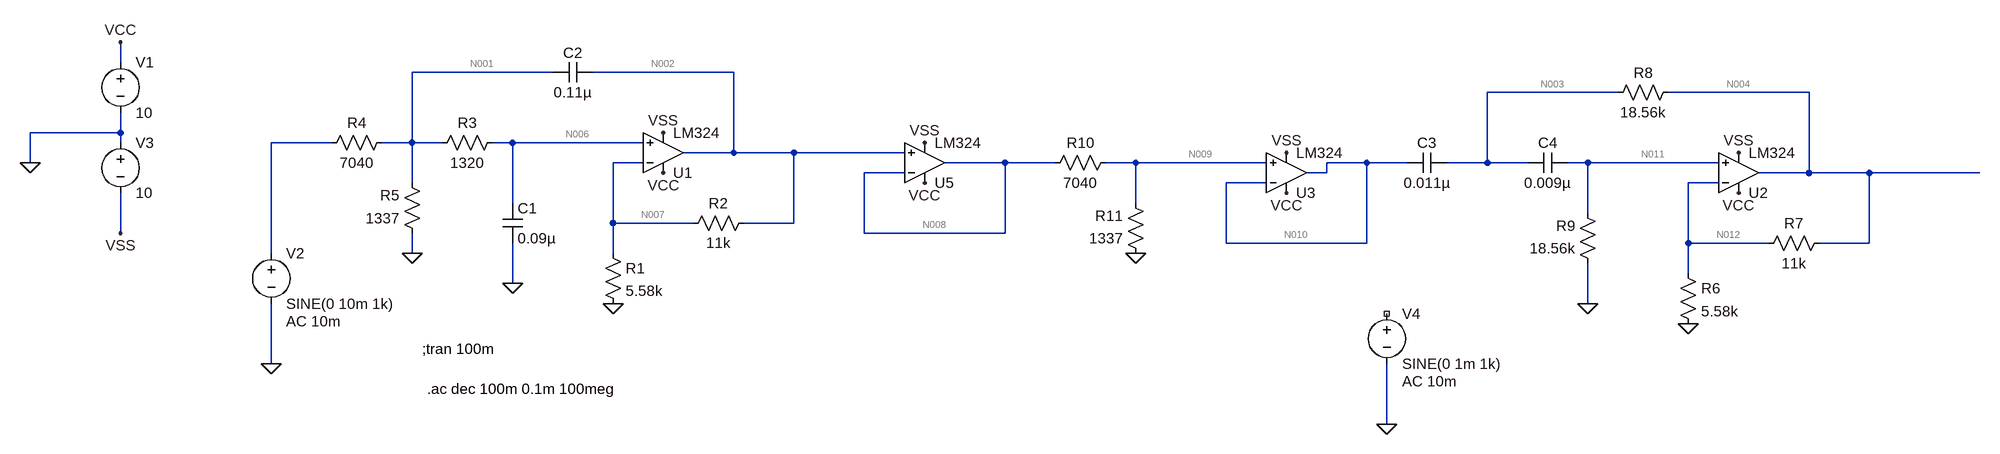
[diagram p0: schematic simulacion1_10porciento.asc]
* simulacion1_10porciento.asc
* U1: LM324 (symbol AutoGenerated\LM324 not available, pins judged from their places): In+=N006 In-=N007 V+=VCC V-=VSS OUT=N002
V1 VCC 0 10
R1 N007 0 5.58k
R2 N002 N007 11k
V2 N005 0 SINE(0 10m 1k) AC 10m
V3 0 VSS 10
C1 N006 0 0.09µ
R3 N006 N001 1320
R4 N001 N005 7040
C2 N002 N001 0.11µ
R5 0 N001 1337
* U2: LM324 (symbol AutoGenerated\LM324 not available, pins judged from their places): In+=N011 In-=N012 V+=VCC V-=VSS OUT=N004
R6 N012 0 5.58k
R7 N004 N012 11k
V4 NC_01 0 SINE(0 1m 1k) AC 10m
R8 N004 N003 18.56k
R9 0 N011 18.56k
C3 N003 N010 0.011µ
C4 N011 N003 0.009µ
R10 N009 N008 7040
R11 0 N009 1337
* U3: LM324 (symbol AutoGenerated\LM324 not available, pins judged from their places): In+=N009 In-=N010 V+=VCC V-=VSS OUT=N010
* U5: LM324 (symbol AutoGenerated\LM324 not available, pins judged from their places): In+=N002 In-=N008 V+=VCC V-=VSS OUT=N008
;tran 100m
.ac dec 100m 0.1m 100meg
.backanno
.end

* Results of the author's LTspice run, read from the files saved beside the schematic
* Operating Point, zero values left out:
*   V(n002) = -174.7 µV
*   V(vss) = -10 V
*   V(vcc) = 10 V
*   V(n007) = 15.03 µV
*   V(n006) = 48.68 µV
*   V(n001) = 22.39 µV
*   V(n004) = 779.3 µV
*   V(n012) = 336.1 µV
*   V(n011) = 369.8 µV
*   V(n003) = 779.3 µV
*   V(n010) = -44.52 µV
*   V(n009) = -10.86 µV
*   V(n008) = -208.3 µV
*   I(R11) = 8.126 nA
*   I(R10) = 28.05 nA
*   I(R9) = -19.92 nA
*   I(R7) = 40.29 nA
*   I(R6) = 60.23 nA
*   I(R5) = -16.74 nA
*   I(R4) = 3.18 nA
*   I(R3) = 19.92 nA
*   I(R2) = -17.25 nA
*   I(R1) = 2.693 nA
*   I(V3) = -2.679 mA
*   I(V2) = 3.18 nA
*   I(V1) = -2.68 mA
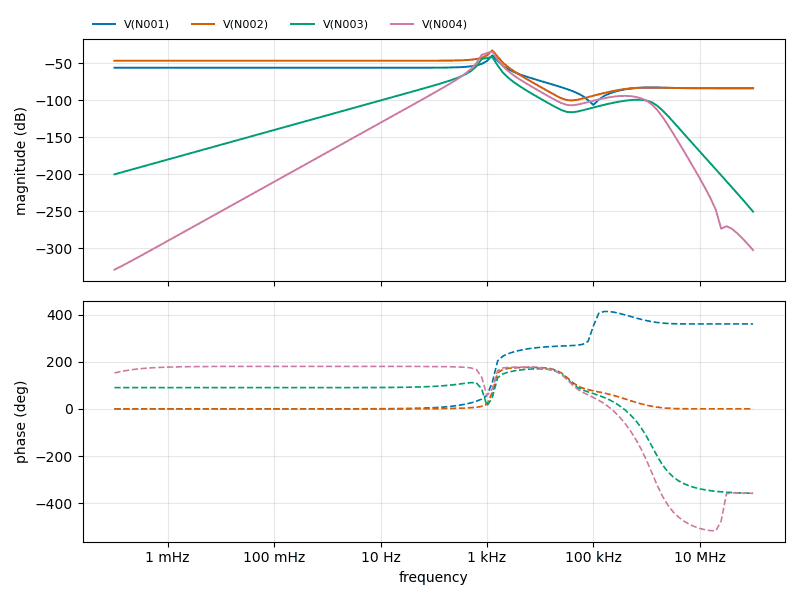
[diagram p1: AC Analysis of simulacion1_10porciento.asc, plotted from the saved traces]
* AC Analysis, 1 run:
*   V(N001): -55.94 dB at 100 µHz, -83.68 dB at 100 MHz, peak -39.23 dB at 1.259 kHz, 3 dB below the peak at 1.15 kHz and 1.383 kHz
*   V(N002): -46.48 dB at 100 µHz, -83.68 dB at 100 MHz, peak -32.52 dB at 1.259 kHz, 3 dB below the peak at 1.137 kHz and 1.367 kHz
*   V(N003): -200.26 dB at 100 µHz, -250.76 dB at 100 MHz, peak -41.46 dB at 1.259 kHz, 3 dB below the peak at 789.7 Hz and 1.339 kHz
*   V(N004): -329.31 dB at 100 µHz, -302.78 dB at 100 MHz, peak -33.97 dB at 1.259 kHz, 3 dB below the peak at 926.5 Hz and 1.344 kHz